# EAGLE design flasher_with_opto (EAGLE 7.7.0)
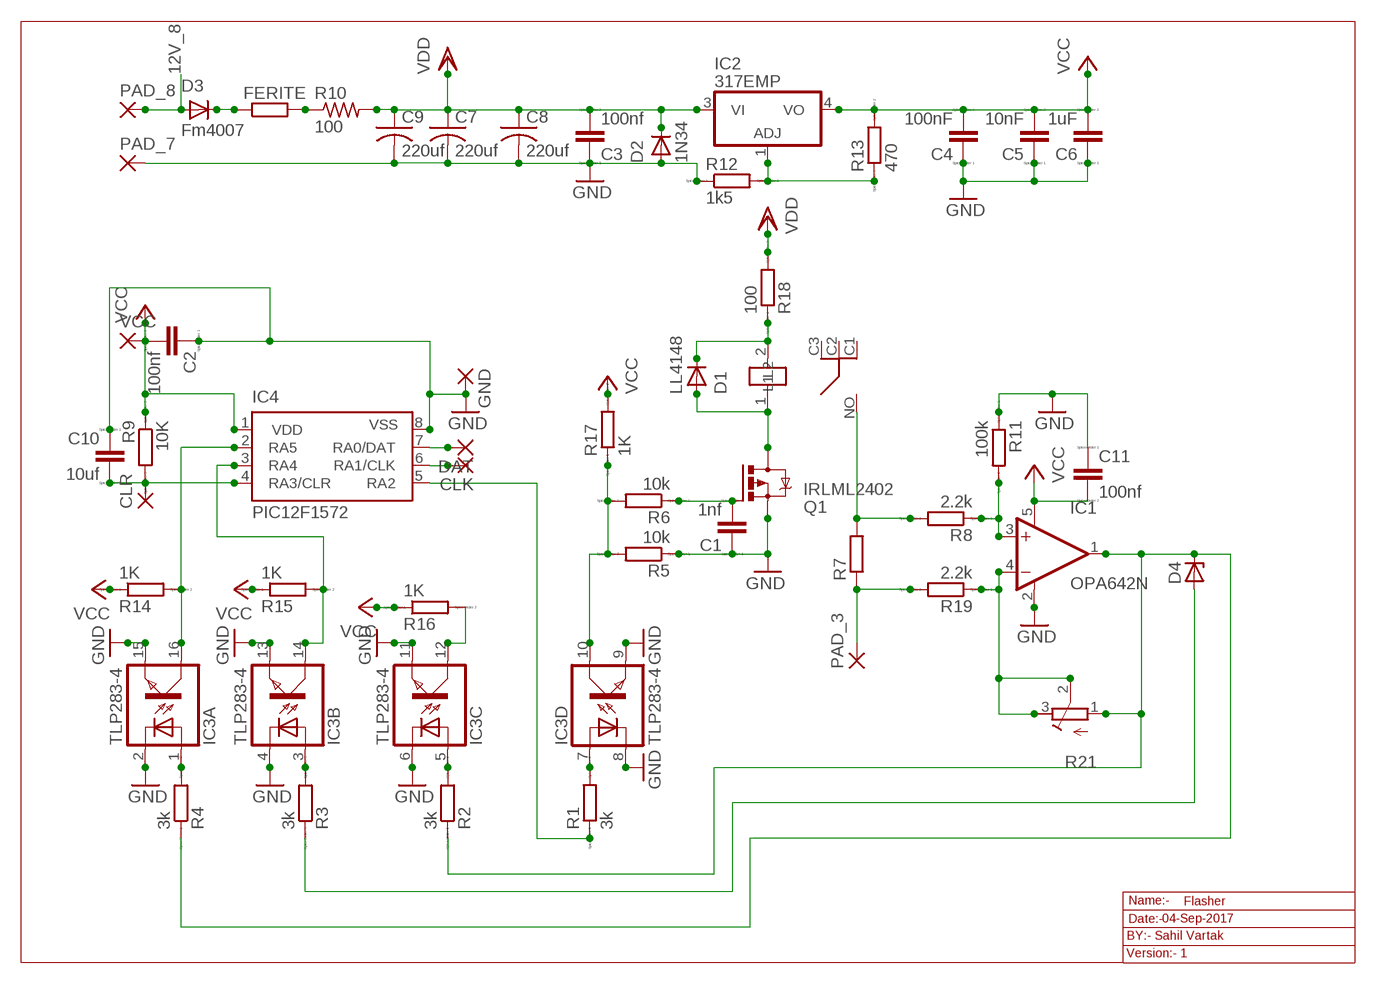
[diagram p0: schematic, sheet 1]

## Parts
C1  1nf  CC0603  [C0603]
C2  100nf  CC0603  [C0603]
C3  100nf  CC0603  [C0603]
C4  100nF  CC0603  [C0603]
C5  10nF  CC0603  [C0603]
C6  1uF  CC0603  [C0603]
C7  220uf  C-US025-025X050  [C025-025X050]
C8  220uf  C-US025-025X050  [C025-025X050]
C9  220uf  C-US025-025X050  [C025-025X050]
C10  10uf  CC0603  [C0603]
C11  100nf  CC0603  [C0603]
CLK  1,6/0,8  [1,6/0,8]
CLR  1,6/0,8  [1,6/0,8]
D1  LL4148  GF1  [SMA-DO214AC]
D2  1N34  GF1  [SMA-DO214AC]
D3  Fm4007  GF1  [SMA-DO214AC]
D4  ZENER-DIODESOD80C  [SOD80C]
DAT  1,6/0,8  [1,6/0,8]
FERITE  R-EU_R0603  [R0603]
GND  1,6/0,8  [1,6/0,8]
IC1  OPA642N  [SOT23-5]
IC2  317EMP  [SOT223]
IC3  TLP283-4  [MINI-FLAT-16]
IC4  PIC12F1572  PIC12F675SN  [SO-08]
K2  RL703  [RL703]
PAD_3  2,54/1,1  [2,54/1,1]
PAD_7  2,54/1,1  [2,54/1,1]
PAD_8  2,54/1,1  [2,54/1,1]
Q1  IRLML2402  IRLML5203  [MICRO3]
R1  3k  RR0603  [R0603]
R2  3k  RR0603  [R0603]
R3  3k  RR0603  [R0603]
R4  3k  RR0603  [R0603]
R5  10k  RR0603  [R0603]
R6  10k  RR0603  [R0603]
R7  R-EU_VTA54  [VTA54]
R8  2.2k  RR0603  [R0603]
R9  10K  RR0603  [R0603]
R10  100  R-US_WSC2515  [WSC2515]
R11  100k  RR0603  [R0603]
R12  1k5  RR0603  [R0603]
R13  470  RR0603  [R0603]
R14  1K  RR0603  [R0603]
R15  1K  RR0603  [R0603]
R16  1K  RR0603  [R0603]
R17  1K  RR0603  [R0603]
R18  100  RR0603  [R0603]
R19  2.2k  RR0603  [R0603]
R21  R-TRIMMTS63X  [RTRIMTS63X]
VCC  1,6/0,8  [1,6/0,8]

## Nets
12V_8: D3.A PAD_8.1(P)
GND: C1.1 C2.1 C3.1 C4.1 C5.1 C6.1 C7.2 C8.2 C9.2 C10.1 C11.1 D2.A GND.1(P) IC1.2(V-) IC3.2(A:C) IC3.4(B:C) IC3.6(C:C) IC3.8(D:C) IC3.9(D:EMIT) IC3.11(C:EMIT) IC3.13(B:EMIT) IC3.15(A:EMIT) IC4.8(VSS) PAD_7.1(P) Q1.2(S) R5.1 R11.1 R12.1
N$3: IC3.10(D:COL) R5.2 R6.2 R17.1
N$5: D1.A K2.1(L2) Q1.3(D)
N$7: D3.K(C) FERITE.1
N$8: DAT.1(P) IC4.7(RA0/DAT)
N$9: CLK.1(P) IC4.6(RA1/CLK)
N$13: D1.K(C) K2.2(L1) R18.1
N$14: IC2.1(ADJ) R12.2 R13.1
N$15: FERITE.2 R10.1
N$16: K2.NO R7.2 R8.2
N$17: IC3.12(C:COL) R16.2
N$18: IC4.5(RA2) R1.1
N$19: PAD_3.1(P) R7.1 R19.2
N$20: IC3.14(B:COL) IC4.3(RA4) R15.2
N$21: IC1.4(-IN) R19.1 R21.2(S) R21.3(E)
N$22: IC1.3(+IN) R8.1 R11.2
N$23: D4.C IC1.1(OUT) R2.1 R4.1 R21.1(A)
N$25: D4.A R3.1
N$72: C1.2 Q1.1(G) R6.1
N$76: IC3.1(A:A) R4.2
N$78: IC3.3(B:A) R3.2
N$80: IC3.5(C:A) R2.2
N$82: IC3.7(D:A) R1.2
N$85: IC3.16(A:COL) IC4.2(RA5) R14.2
N$87: C10.2 CLR.1(P) IC4.4(RA3/CLR) R9.2
VCC: C2.2 C4.2 C5.2 C6.2 C11.2 IC1.5(V+) IC2.4(VO) IC4.1(VDD) R9.1 R13.2 R14.1 R15.1 R16.1 R17.2 VCC.1(P)
VDD: C3.2 C7.1 C8.1 C9.1 D2.K(C) IC2.3(VI) R10.2 R18.2
Unconnected: K2.C1 K2.C2 K2.C3

## Notes on the sheet
- Name:- | Flasher
- Date:- | 04-Sep-2017
- BY:- Sahil Vartak
- Version:- 1

## Library data of the parts
C1-C6 C10 C11 = eagle-ltspice:C: CAPACITOR, European symbol; SPICEMODEL: NONE; SPICEPREFIX: C
C7-C9 = rcl:C-US: CAPACITOR, American symbol
CLK CLR DAT GND VCC = wirepad:1,6/0,8: THROUGH-HOLE PAD
D1-D3 = diode:GF1: DIODE
D4 = diode:ZENER-DIODE: Z-Diode
FERITE = resistor:R-EU_: RESISTOR, European symbol
IC1 = burr-brown:OPA642N: Operational Amplifier Wideband, Low Distortion; OC_FARNELL: unknown; OC_NEWARK: unknown
IC2 = lm317:*317: Positive VOLTAGE REGULATOR
IC3 = optocoupler:TLP283-4: TOSHIBA PHOTOCOUPLER GaAs IRED & PHOTO-TRANSISTOR Source: http://www.semicon.toshiba.co.jp/td/en/Opto/Photocoupler/en_20050928_TLP283_datasheet.pdf; OC_FARNELL: unknown; OC_NEWARK: unknown
IC4 = microchip:PIC12F6*: Data Sheet 8-Pin FLASH-Based 8-Bit CMOS Microcontrollers Source: http://www.microchip.com .. 41190c.pdf; MF: MICROCHIP; MPN: PIC12F675-E/SN; OC_FARNELL: 9759026; OC_NEWARK: 92C4341
K2 = relay:RL703
PAD_3 PAD_7 PAD_8 = wirepad:2,54/1,1: THROUGH-HOLE PAD
Q1 = transistor-power:IRLML5203: HEXFET P-Channel Power MOSFET
R1-R6 R8 R9 R11-R19 = eagle-ltspice:R: RESISTOR, European symbol; SPICEMODEL: NONE; SPICEPREFIX: R
R7 = rcl:R-EU_: RESISTOR, European symbol
R10 = resistor:R-US_: RESISTOR, American symbol
R21 = rcl:R-TRIMM: Trimm resistor

## Board
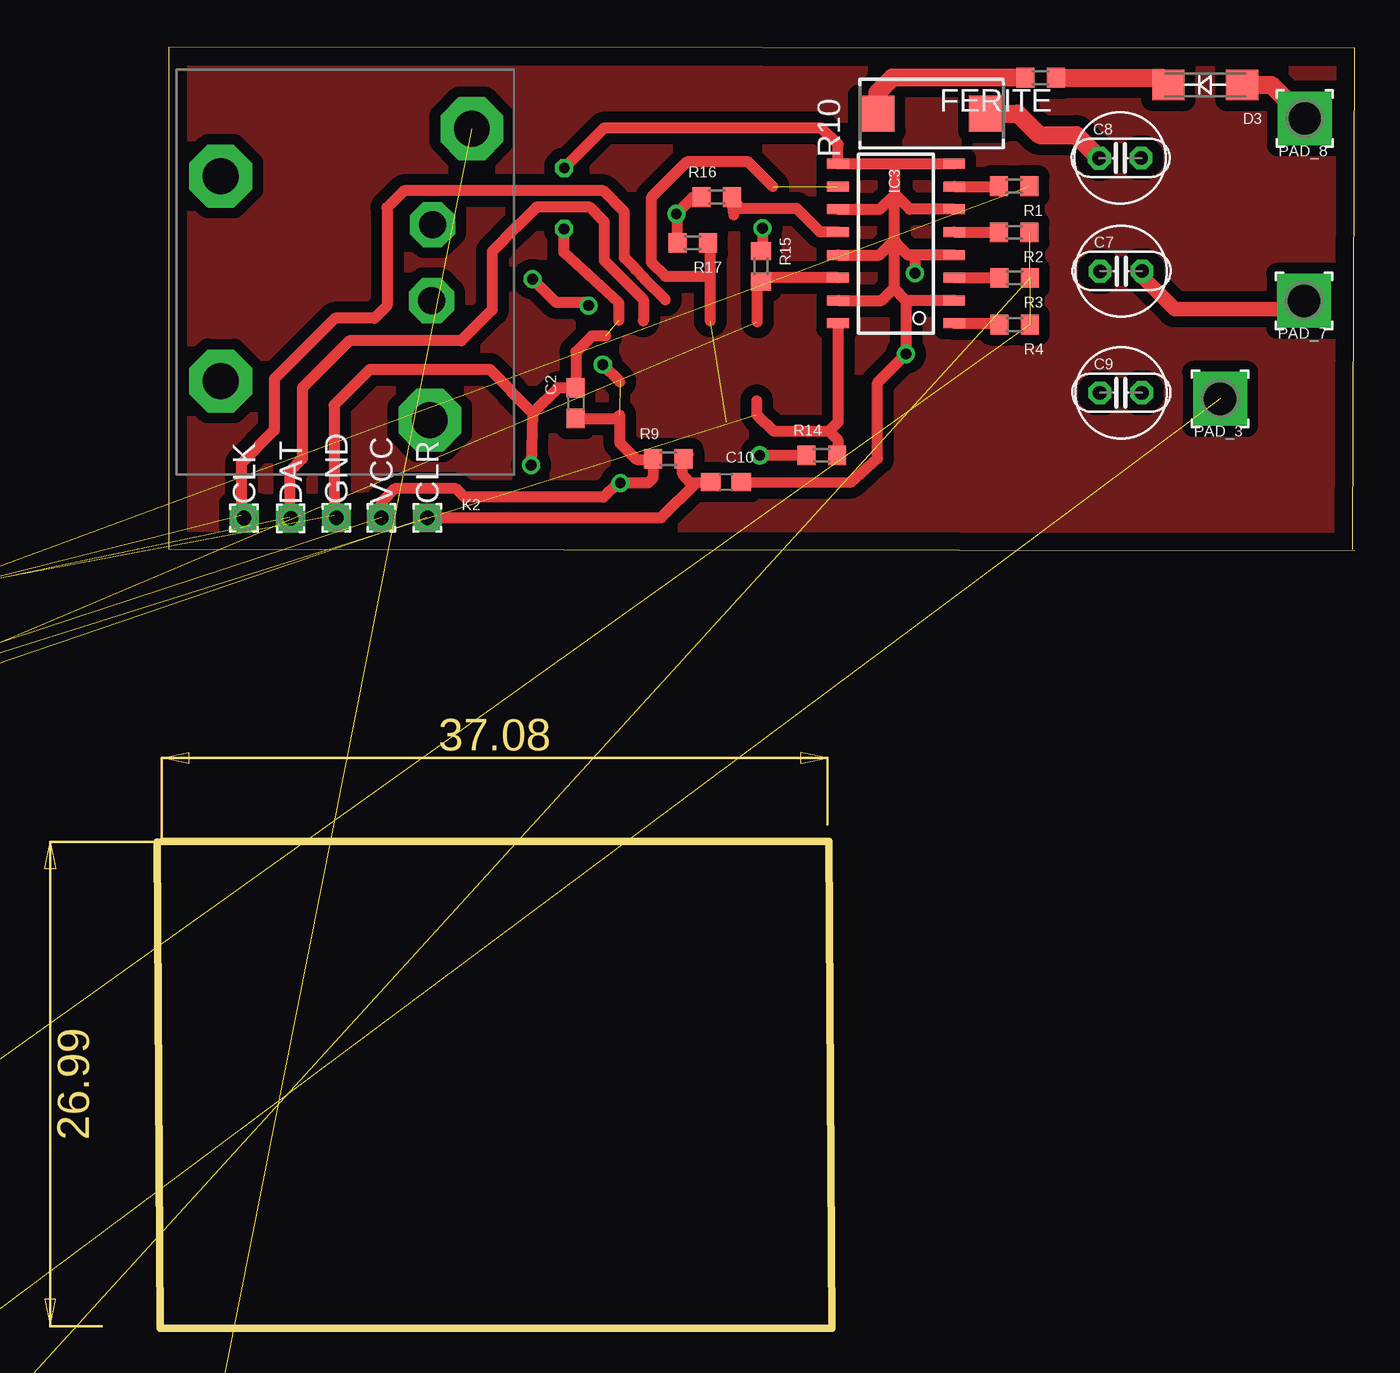
[diagram p1: board, top side]
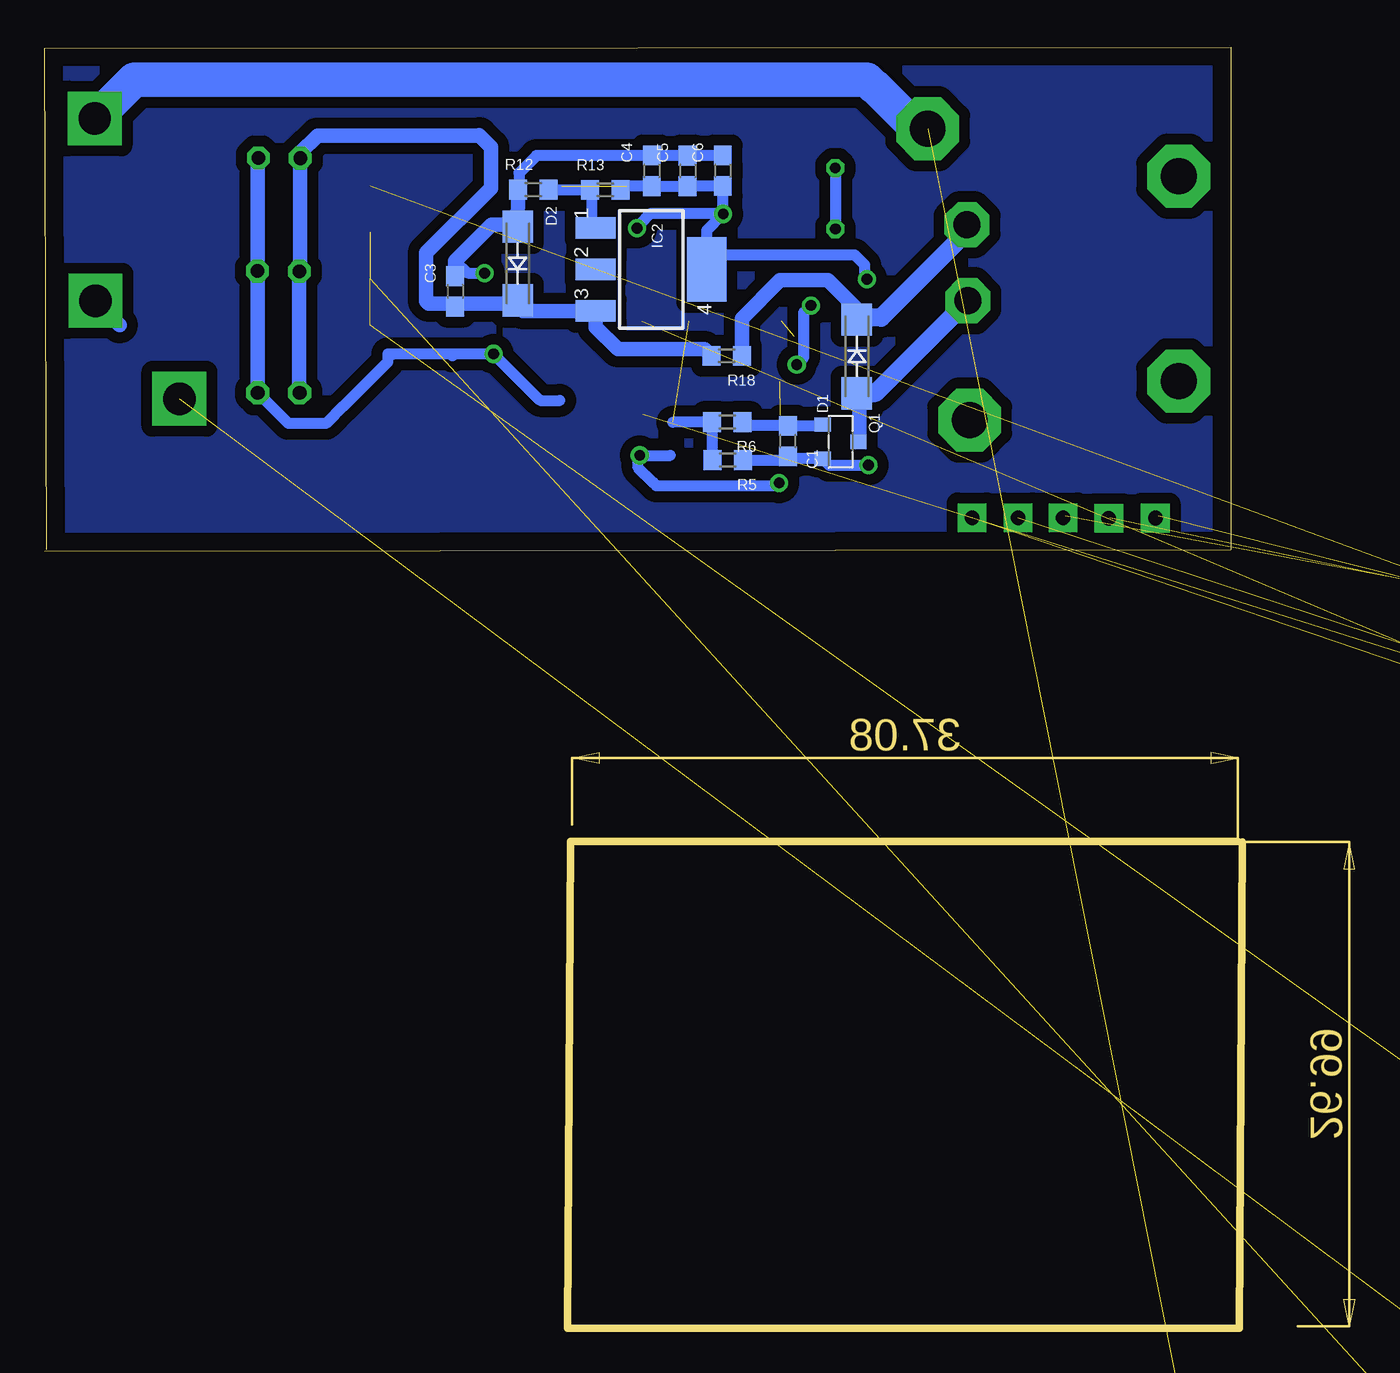
[diagram p2: board, bottom side, seen from below]

Size 66.74 x 71.39 mm. Coordinates in mm from the lower left corner, seen from the top.
Outline: 66.64,43.38 66.74,71.33 0.64,71.39 0.64,43.38 66.74,43.32
Outline: 0.27,27.11 37.43,27.11 37.62,0 0.19,0 0,27.09
Copper layers (1*16): Top 0.035mm / dielectric 1.5mm / Bottom 0.035mm
Design rules "default": minimum track width 10mil, minimum drill 24mil, track to track 8mil, track to pad 8mil, pad to pad 8mil, via to via 8mil, smd to smd 8mil, copper to edge 40mil, drill to drill 8mil, minimum pad ring 10mil, minimum via ring 8mil, stop-mask expansion 4mil, vias tented up to drill 0mil, thermal gap 10mil

### Footprints (pad centres in the part's own frame; a part is rotated, then mirrored left to right if it is on the bottom)
C0603 = smd 1.1 x 1: 1 -0.85,0; 2 0.85,0
C025-025X050 = drill 0.762 pad 1.27 octagon: 1 -1.176,-0.006; 2 1.159,0.007
1,6/0,8 = drill 0.813 pad 1.6 square: 1 0,0
SMA-DO214AC = smd 1.8 x 1.7: A -2.05,0; K 2.05,0
SOD80C = smd 1.4 x 1.8: A 1.7,0; C -1.7,0
R0603 = smd 1 x 1.1: 1 -0.85,0; 2 0.85,0
SOT23-5 = smd 0.6 x 1.2: 1 -0.95,-1.306; 2 0,-1.306; 3 0.95,-1.306; 4 0.95,1.306; 5 -0.95,1.306
SOT223 = smd 1.219 x 2.235: 1 -2.311,-3.099; 2 0,-3.099; 3 2.311,-3.099 | smd 3.6 x 2.2: 4 0,3.099
MINI-FLAT-16 = smd 1.2 x 0.56: 1 -3.24,4.445; 2 -3.24,3.175; 3 -3.24,1.905; 4 -3.24,0.635; 5 -3.24,-0.635; 6 -3.24,-1.905; 7 -3.24,-3.175; 8 -3.24,-4.445; 9 3.24,-4.445; 10 3.24,-3.175; 11 3.24,-1.905; 12 3.24,-0.635; 13 3.24,0.635; 14 3.24,1.905; 15 3.24,3.175; 16 3.24,4.445
SO-08 = smd 0.6 x 2.2: 1 -1.905,-2.6; 2 -0.635,-2.6; 3 0.635,-2.6; 4 1.905,-2.6; 5 1.905,2.6; 6 0.635,2.6; 7 -0.635,2.6; 8 -1.905,2.6
RL703 = drill 1.5 pad 2.5 octagon: 1 1.73,-5.643; 2 -2.51,-5.693 | drill 2 pad 3.5 octagon: C1 8.38,-5.543; C2 6.2,6.107; C3 -5.21,6.107; NO -7.86,-7.883
2,54/1,1 = drill 1.8 pad 3 square: 1 0,0
MICRO3 = smd 0.8 x 0.9: 1 -0.95,-1; 2 0.95,-1; 3 0,1
VTA54 = drill 1.1 octagon: 1 -12.065,0; 2 12.065,0
WSC2515 = smd 2 x 2: 1 -3.075,0; 2 3.075,0
RTRIMTS63X = smd 1 x 3: 1 -2.55,-2.25; 2 0,2.25; 3 2.55,-2.25

### Placement (x,y rotation side)
C1  25.33,49.44 90 bottom
C2  23.33,51.54 270 top
C3  43.87,57.78 270 bottom
C4  32.92,64.49 270 bottom
C5  30.92,64.49 270 bottom
C6  28.96,64.49 270 bottom
C7  53.73,58.9 0 top
C8  53.68,65.2 0 top
C9  53.72,52.12 0 top
C10  31.7,47.14 180 top
C11  -39.06,-41.49 0 top  (outside the outline)
CLK  4.85,45.14 0 top
CLR  15.06,45.16 0 top
D1  21.48,54.15 90 bottom
D2  40.39,59.33 270 bottom
D3  58.41,69.28 180 top
D4  -39.24,-36.19 0 top  (outside the outline)
DAT  7.45,45.12 0 top
FERITE  49.24,69.68 180 top
GND  9.99,45.15 0 top
IC1  -26.32,3.11 0 top  (outside the outline)
IC2  32.95,59 270 bottom
IC3  41.19,60.44 180 top
IC4  -18.4,37.03 0 top  (outside the outline)
K2  9.66,58.98 270 bottom
PAD_3  59.25,51.79 180 top
PAD_7  63.92,57.25 180 top
PAD_8  63.96,67.41 180 top
Q1  22.4,49.4 270 bottom
R1  47.77,63.64 180 top
R2  47.77,61.06 180 top
R3  47.79,58.52 180 top
R4  47.79,55.92 180 top
R5  28.68,48.37 180 bottom
R6  28.71,50.49 180 bottom
R7  -9.47,-8.46 0 top  (outside the outline)
R8  -27.67,-19 0 top  (outside the outline)
R9  28.49,48.44 0 top
R10  43.17,67.68 0 top
R11  -27.67,-23.12 0 top  (outside the outline)
R12  39.52,63.45 0 bottom
R13  35.52,63.43 0 bottom
R14  37.05,48.64 0 top
R15  33.66,59.18 270 top
R16  31.19,63.03 0 top
R17  29.86,60.47 180 top
R18  28.75,54.18 180 bottom
R19  -27.67,-27.24 0 top  (outside the outline)
R21  -36.36,-25.94 0 top  (outside the outline)
VCC  12.5,45.15 0 top

### Tracks (layer width: path | path; a pad name or v marks a point on that pad's centre or on a via)
12V_8
  Top 1.016: D3.A 62.09,69.28 PAD_8.1
  Bottom 1.93: PAD_8.1 63.92,67.41 61.75,69.58 20.94,69.58 20.53,69.17 20.47,69.17 17.94,66.64
GND  (via drill 0.6)  (5 unrouted)
  Top 0.406: 41.12,64.88 41.12,64.54
  Top 0.61: IC3.8 41.08,64.88 41.12,64.85 41.12,64.54 41.12,63.18 | IC3.11 40.28,62.34 41.08,63.14 | IC3.6 41.95,62.34 41.12,63.18 | IC3.4 42.24,59.8 | 42.24,59.8 41.84,59.8 41.23,60.41 41.23,60.47 41.12,60.58 | 41.12,60.58 41.08,60.61 | 41.08,60.61 41.08,63.14 | 41.08,63.14 41.12,63.18 | IC3.13 40.27,59.8 41.08,60.61 | IC3.2 41.74,57.26 | 41.74,57.26 41.06,57.95 | 41.12,60.58 41.06,60.51 41.06,57.95 | IC3.15 40.37,57.26 41.06,57.95 | 20.94,50.99 22.34,52.39 C2.1 23.34,52.41 23.34,54.39 24.24,55.29 25,55.29 | 20.94,50.99 v20.84,48.09 | 42.24,59.8 v42.24,58.79 | 41.74,57.26 v41.74,54.29 | v41.74,54.29 | C10.1 38.64,47.13 40.15,48.48 40.15,52.7 v41.74,54.29 | 20.94,50.99 19.71,52.22 19.71,52.26 18.55,53.42 11.85,53.42 9.86,51.43 9.86,45.28 GND.1 | v22.69,64.65 24.92,66.88 37.03,66.88 37.95,65.97 IC3.9 41.12,64.88 | v22.69,61.25 v22.68,61.25 22.68,59.94 25.73,57.14 25.73,56.15
  Top 0.813: C7.2 55,58.5 56.71,56.79 63.46,56.79 PAD_7.1
  Bottom 0.61: R5.1 25.54,48.37 C1.1 25.18,48.45 Q1.2 23.04,48.09 v20.84,48.09 | C5.1 | C6.1 C5.1 | 43.87,59.46 43.19,58.79 v42.24,58.79 | 43.94,54.29 v41.74,54.29 39.14,51.69 38.03,51.69 | 43.94,54.29 47.46,54.29 | 47.46,54.29 47.62,54.29 47.62,53.84 50.1,51.37 50.11,51.37 51.07,50.41 53.16,50.41 C9.2 | 44.04,54.19 43.94,54.29 | 47.41,54.24 47.46,54.29 | R12.1 40.32,63.49 40.32,64.36 39.34,65.34 C4.1 C5.1 | v22.69,64.65 22.69,61.51 v22.69,61.25 | 54.88,58.9 C7.2
  Bottom 0.813: 40.57,61.09 D2.A | R12.1 40.4,61.27 D2.A | D2.A 40.5,61.49 41.84,61.49 43.87,59.46 C3.1 43.91,58.58 | 62.57,55.9 PAD_7.1 | C7.2 54.89,65.16 C8.2 | 54.88,58.9 C9.2
N$1
  pour Bottom (isolate 0.61): 66.64,43.38 0.64,43.38 0.64,71.29 66.64,71.29
N$3  (2 unrouted)
  Top 0.61: 30.84,56.12 30.84,58.64 | 30.84,58.64 30.84,60.34 R17.1 | 34.32,63.61 32.94,64.99 29.54,64.99 27.54,62.99 27.54,59.41 28.33,58.62 30.82,58.62 30.84,58.64
  Bottom 0.61: R5.2 29.52,50.35 R6.2 31.73,50.49
N$5
  Bottom 0.61: 21.34,49.45 Q1.3 | 21.34,51.95 D1.A
  Bottom 0.813: 21.34,49.45 21.34,51.95
  Bottom 1.016: D1.A 20.44,52.11 K2.1
N$6
  pour Top (isolate 0.61): 66.54,43.38 0.64,43.38 0.64,71.29 66.54,71.29
N$7
  Top 1.016: FERITE.1 55.96,69.68 D3.K
N$8  (1 unrouted)
  Top 0.61: 20.03,61.33 20.03,61.34 | 20.03,61.34 21.17,62.48 24.09,62.48 24.92,61.65 24.92,59.5 27.1,57.32 27.1,56.12 | 20.03,61.34 20.02,61.34 18.68,60 18.68,56.75 16.95,55.02 10.73,55.02 8.1,52.39 8.1,48.45 7.39,47.74 7.39,45.18 DAT.1
N$9  (1 unrouted)
  Top 0.61: 28.33,57.31 27.15,58.49 27.15,58.52 26.66,59.01 26.66,59.03 26.05,59.64 26.05,62.2 24.87,63.38 13.76,63.38 12.82,62.44 12.82,56.97 12.12,56.27 9.92,56.27 6.54,52.89 6.54,50.03 4.7,48.19 4.7,45.29 CLK.1
N$13
  Bottom 0.813: D1.K 21.48,56.77 23.1,58.39 25.76,58.39 27.9,56.25 R18.1
  Bottom 1.016: K2.2 15.35,61.09 20.14,56.3 21.38,56.3 D1.K
N$14
  Bottom 0.61: IC2.1 36.24,61.5 36.24,63.3 R13.1 R12.2
N$15
  Top 1.016: FERITE.2 40.98,69.68 40.14,68.84 40.14,67.72 R10.1
N$16  (2 unrouted)
N$17
  Top 0.61: 32.14,62.03 R16.2 32.51,62.39 35.65,62.39 36.97,61.07 IC3.12
N$18  (1 unrouted)
N$19  (2 unrouted)
N$20  (1 unrouted)
  Top 0.61: 33.65,58.53 R15.2 | IC3.14 33.87,58.53 R15.2 | 33.46,56.09 33.46,58.13 R15.2
N$21  (3 unrouted)
N$22  (2 unrouted)
N$23  (4 unrouted)
N$25  (1 unrouted)
N$72
  Bottom 0.61: R6.1 27.76,50.29 C1.2 23.45,50.29 Q1.1
N$76
  Top 0.61: IC3.1 46.86,55.99 R4.2
N$78
  Top 0.61: IC3.3 46.92,58.53 R3.2
N$80
  Top 0.61: IC3.5 46.9,61.07 R2.2
N$82
  Top 0.61: IC3.7 46.89,63.61 R1.2
N$85  (1 unrouted)
  Top 0.61: IC3.16 37.95,50.49 37.44,49.99 | 33.41,51.66 33.41,50.92 34.34,49.99 37.44,49.99 | 37.44,49.99 37.94,49.49 37.94,48.67 R14.2
N$87  (1 unrouted)
  Top 0.61: 29.6,48.7 R9.2 29.29,48.39 29.29,47.6 29.74,47.08 30.03,47.09 | C10.2 30.03,47.09 | 30.03,47.09 28.09,45.16 CLR.1
VCC  (via drill 0.6)  (4 unrouted)
  Top 0.61: C2.2 25.6,50.69 25.77,50.87 25.77,49.34 26.71,48.4 27.6,48.4 R9.1 | 27.61,48.41 R9.1 | R9.1 | v33.74,61.29 33.74,60.11 R15.1 | 29,62.03 v28.94,62.09 | 25.79,52.74 v24.84,53.69 | v33.59,48.64 R14.1 | R17.2 29.01,62.02 v28.94,62.09 | R16.1 29.88,63.03 v28.94,62.09 | R9.1 27.64,48.43 27.63,48.43 27.63,47.36 27.37,47.1 v25.82,47.1 | v25.82,47.1 | 24,57.03 v24.04,56.99 23.88,57.15 22.24,57.15 v20.93,58.46 | v25.82,47.1 25.68,47.1 24.88,46.3 17.14,46.3 16.66,46.78 13.25,46.78 12.51,46.04 VCC.1
  Bottom 0.61: v28.94,62.09 28.94,63.62 C6.2 C5.2 C4.2 34.17,63.64 R13.2 | 31.88,48.64 v33.59,48.64 33.67,48.55 33.67,47.93 32.86,47.12 32.84,47.12 32.66,46.94 25.98,46.94 v25.82,47.1 | v28.94,62.09 33.04,62.09 v33.74,61.29 | 29.85,59.54 IC2.4 29.5,59.34 | 29.85,59.54 29.85,61.18 v28.94,62.09 | v24.84,53.69 24.44,54.09 24.44,56.59 v24.04,56.99 | 29.7,59.39 29.85,59.54 | 29.43,59.41 29.5,59.34 | 29.5,59.34 29.5,59.48 29.17,59.81 21.62,59.81 21.06,59.25 21.06,58.59 v20.93,58.46
VDD
  Top 1.016: R10.2 47.97,67.68 49.17,66.48 51.22,66.48 C8.1
  Bottom 0.61: 40.09,56.69 D2.K
  Bottom 0.813: 43.93,56.99 C3.2 | D2.K 40.59,57.08 43.72,57.08 | 40.09,56.69 IC2.3 36.04,55.79 34.81,54.56 29.98,54.56 R18.2 | 43.94,56.85 C3.2 | 43.91,56.88 C3.2 | 43.72,57.08 45.35,57.08 45.49,57.22 45.49,59.92 41.88,63.53 41.88,65.81 42.55,66.48 42.57,66.46 51.55,66.46 52.5,65.51 C8.1 52.5,58.94 C7.1 52.55,52.12 C9.1 | 43.72,57.08 C3.2